# Altium schematic sheet Sensores.SchDoc
size A4; Organization: Altium Limited; Address1: 3 Minna Close; Address2: Belrose; Address3: NSW 2085; Address4: Australia
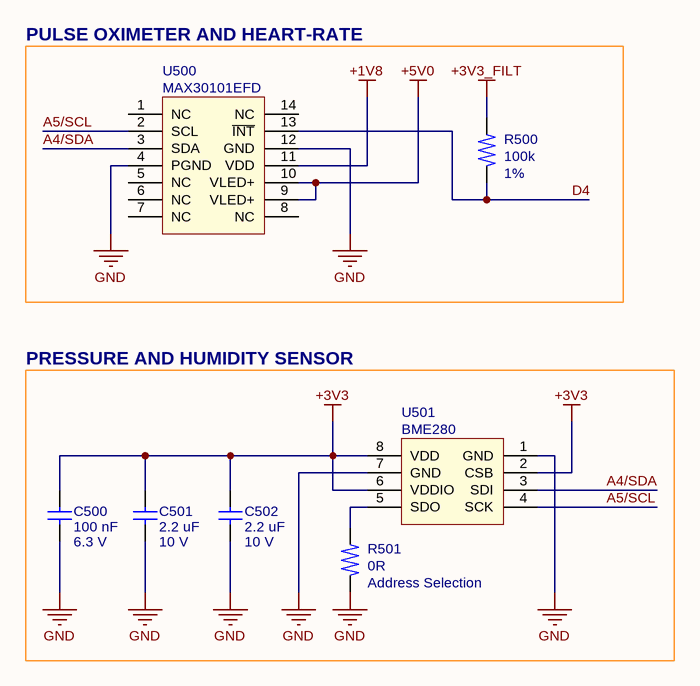
[diagram p0: Sensores.SchDoc]

## Parts
C500  value 100 nF  Voltage Max: 6.3 V  [C0201]  (hidden comment: Capacitor no polarized)
C501  value 2.2 uF  Voltage Max: 10 V  [C0201]  (hidden comment: Capacitor no polarized)
C502  value 2.2 uF  Voltage Max: 10 V  [C0201]  (hidden comment: Capacitor no polarized)
R500  value 100k  Tolerance: 1%  [R0201]  (hidden comment: R)
R501  value 0R  [R0201]  (hidden comment: R)
U500  MAX30101EFD  [OLGA-14]
U501  BME280  [8-LGA_2X5_2X5]

## Blocks framed on the sheet
PULSE OXIMETER AND HEART-RATE: R500 U500
PRESSURE AND HUMIDITY SENSOR: C500-C502 R501 U501

## Nets
+1V8: U500.11(VDD)
+3V3: C500.2 C501.2 C502.2 U501.2(CSB) U501.6(VDDIO) U501.8(VDD)
+3V3_FILT: R500.1
+5V0: U500.9(VLED+) U500.10(VLED+)
GND: C500.1 C501.1 C502.1 R501.2 U500.4(PGND) U500.12(GND) U501.1(GND) U501.7(GND)
A4/SDA: U500.3(SDA) U501.3(SDI)
A5/SCL: U500.2(SCL) U501.4(SCK)
D4: R500.2 U500.13(~{INT})
NetR501_1: R501.1 U501.5(SDO)

Not connected (* = marked no-connect by the designer): U500 1(NC) 5(NC) 6(NC) 7(NC) 8(NC) 14(NC)

## Notes on the sheet
- (near R501) Address Selection
- Title
- Size:
- Date:
- A4
- Number:
- Time:
- Revision:
- Sheet
- of
- File:

## Library data of the parts
C500 = Capacitor no polarized: Generic Capacitor; Manufacturer: Murata; Dielectric: X5R; Tolerance: 10%; Reference: GMD033R60J104KE11D; Component URL: https://product.tdk.com/en/search/capacitor/ceramic/mlcc/info?part_no=C1608X5R0J156M080AC; Current Max: *; Package: 0201; Package Description: *; Power Max: *; Supplier 1: Mouser; Supplier 2: Farnell; Supplier 3: Digikey; Supplier 1 Part Number: 81-GMD033R60J104KE1D; Supplier 2 Part Number: 1657913; Supplier 3 Part Number: 490-14513-1-ND; ESR: *; Voltage Min: *; Voltage Typ: *
C501 C502 = Capacitor no polarized: Generic Capacitor; Manufacturer: Murata; Dielectric: X5R; Tolerance: 10%; Reference: GRM033R61A225KE47D; Component URL: https://product.tdk.com/en/search/capacitor/ceramic/mlcc/info?part_no=C1608X5R0J156M080AC; Current Max: *; Package: 0201; Package Description: *; Power Max: *; Supplier 1: Mouser; Supplier 2: Farnell; Supplier 3: Digikey; Supplier 1 Part Number: 81-GRM033R61A225KE7D; Supplier 2 Part Number: 3581639; Supplier 3 Part Number: 490-13227-1-ND; ESR: *; Voltage Min: *; Voltage Typ: *
R500 = R: Generic Resistor; Manufacturer: VISHAY/DALE; Power Max: 0.0050 W; Reference: CRCW0201100KFKED; Voltage Max: 30 V; Component URL: *; Current Max: *; Dielectric: *; Package: 0201; Package Description: *; Supplier 1: Mouser; Supplier 2: Farnell; Supplier 3: Digikey; Supplier 1 Part Number: 71-CRCW0201100KFKED; Supplier 2 Part Number: 2616720; Supplier 3 Part Number: 541-100KAABCT-ND; Voltage Min: *; Voltage Typ: *; ESR: *
R501 = R: Generic Resistor; Manufacturer: Yageo; Power Max: 0.050 W; Tolerance: 0.1%; Reference: RC0201FR-070RL; Voltage Max: 25 V; Component URL: *; Current Max: *; Dielectric: *; Package: 0201; Package Description: *; Supplier 1: Mouser; Supplier 2: Farnell; Supplier 3: Digikey; Supplier 1 Part Number: 603-RC0201FR-070RL; Supplier 2 Part Number: 2139811; Supplier 3 Part Number: 311-0.0MCT-ND; Voltage Min: *; Voltage Typ: *; ESR: *
U500 = MAX30101EFD: High-Sensitivity Pulse Oximeter and  Heart-Rate Sensor for Wearable Health; Voltage Max: 6.0 V; Voltage Min: 1.8 V; component URL: https://www.maximintegrated.com/en/products/interface/sensor-interface/MAX30101.html/tb_tab2; Current Max: *; ESR: *; Footprint Description: 14-Lead Organic Land Grid Array; Power Max: *; Supplier 1: Mouser; Supplier 2: Farnell; Supplier 3: Digikey; Supplier 1 Part Number: 700-MAX30101EFD+; Supplier 2 Part Number: 2580783; Supplier 3 Part Number: MAX30101EFD+TCT-ND; Tolerance: *; Value: *; Voltage Typ: *; Reference: MAX30101EFD
U501 = BME280: Combined humidity and pressure sensor; Manufacturer: Bosch; Current Max: 0.000714 A; Voltage Max: 4.25 V; Voltage Min: 1.71 V; Component URL: https://www.bosch-sensortec.com/products/environmental-sensors/humidity-sensors-bme280/; ESR: *; Footprint: 8-LGA; Footprint Description: 8-Lead Land Grid Array; Power Max: *; Supplier 1: Mouser; Supplier 2: Farnell; Supplier 3: Digikey; Supplier 1 Part Number: 262-BME280; Supplier 2 Part Number: *; Supplier 3 Part Number: 828-1063-1-ND; Tolerance: *; Value: *; Voltage Typ: *; Reference: BME280